# EAGLE schematic karellen (EAGLE 9.6.2)
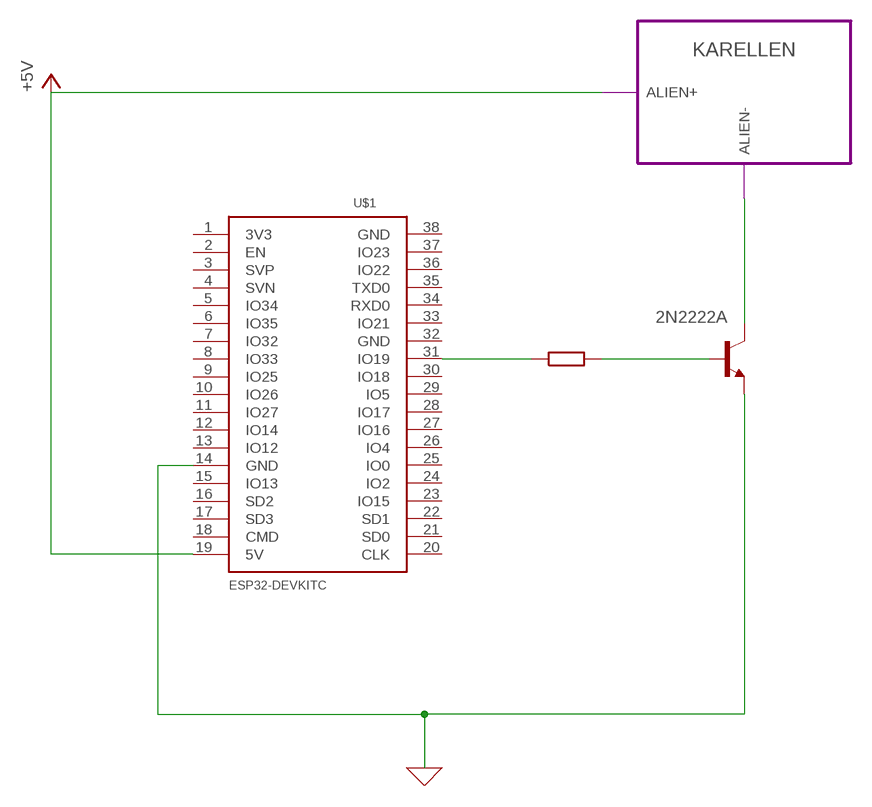
[diagram p0: schematic, sheet 1]

## Parts
T1  2N2222A  [TO18]
U$1  ESP32DEVKITC  [ESP32-DEVKITC]

## Module instances
KARELLEN = KARELLEN

## Nets
0: T1.1(E) U$1.14(GND) ; supply symbol labelled GND
N$1: U$1.31(IO19)
N$2: T1.2(B)
N$3: T1.3(C) ; port KARELLEN.ALIEN-
VCC: U$1.19(5V) ; port KARELLEN.ALIEN+ ; supply symbol labelled +5V
Unconnected: U$1.1(3V3) U$1.2(EN) U$1.3(SVP) U$1.4(SVN) U$1.5(IO34) U$1.6(IO35) U$1.7(IO32) U$1.8(IO33) U$1.9(IO25) U$1.10(IO26) U$1.11(IO27) U$1.12(IO14) U$1.13(IO12) U$1.15(IO13) U$1.16(SD2) U$1.17(SD3) U$1.18(CMD) U$1.20(CLK) U$1.21(SD0) U$1.22(SD1) U$1.23(IO15) U$1.24(IO2) U$1.25(IO0) U$1.26(IO4) U$1.27(IO16) U$1.28(IO17) U$1.29(IO5) U$1.30(IO18) U$1.32(GND) U$1.33(IO21) U$1.34(RXD0) U$1.35(TXD0) U$1.36(IO22) U$1.37(IO23) U$1.38(GND)

## Library data of the parts
T1 = transistor-npn:2N2222*: NPN Transistor
U$1 = ESP32-DEVKITC:ESP32DEVKITC

## Module KARELLEN
Ports: ALIEN+(io) ALIEN-(io)

### Library data of the parts